# EAGLE design csense (EAGLE 5.11)
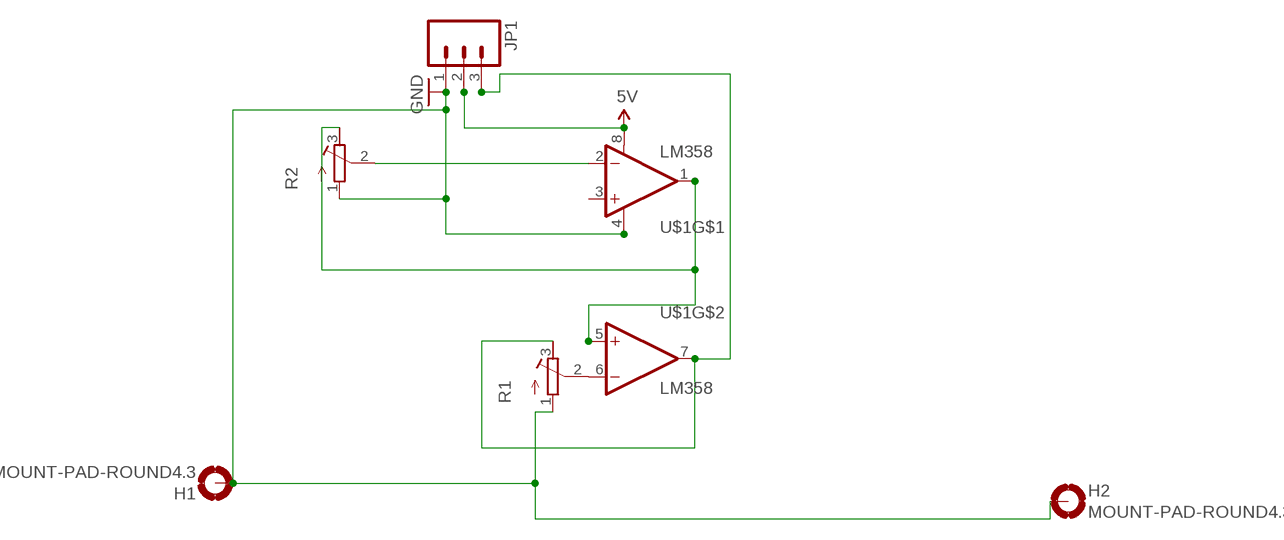
[diagram p0: schematic, sheet 1]

## Parts
H1  MOUNT-PAD-ROUND4.3  [4,3-PAD]
H2  MOUNT-PAD-ROUND4.3  [4,3-PAD]
JP1  M03PTH  [1X03]
R1  R-TRIMM64X  [RTRIM64X]
R2  R-TRIMM64X  [RTRIM64X]
U$1  LM358  [DIP08]

## Nets
5V: JP1.2 U$1.8(V+)
GND: H1.B4,3(MOUNT) H2.B4,3(MOUNT) JP1.1 R1.1(E) R2.1(E) U$1.4(V-)
N$3: R2.3(A) U$1.1(OUT) U$1.5(+IN)
N$4: JP1.3 R1.3(A) U$1.7(OUT)
N$6: R2.2(S) U$1.2(-IN)
N$8: R1.2(S) U$1.6(-IN)
Unconnected: U$1.3(+IN)

## Library data of the parts
H1 H2 = holes:MOUNT-PAD-ROUND: MOUNTING PAD, round
JP1 = SparkFun:M03: Header 3 Standard 3-pin 0.1" header. Use with straight break away headers (SKU : PRT-00116), right angle break away headers (PRT-00553), swiss pins (PRT-00743), machine pins (PRT-00117), and female headers (PRT-00115). Molex polarized connector foot print use with SKU : PRT-08232 with associated crimp pins and housings.
R1 R2 = rcl:R-TRIMM: Trimm resistor
U$1 = SparkFun:LM358

## Board
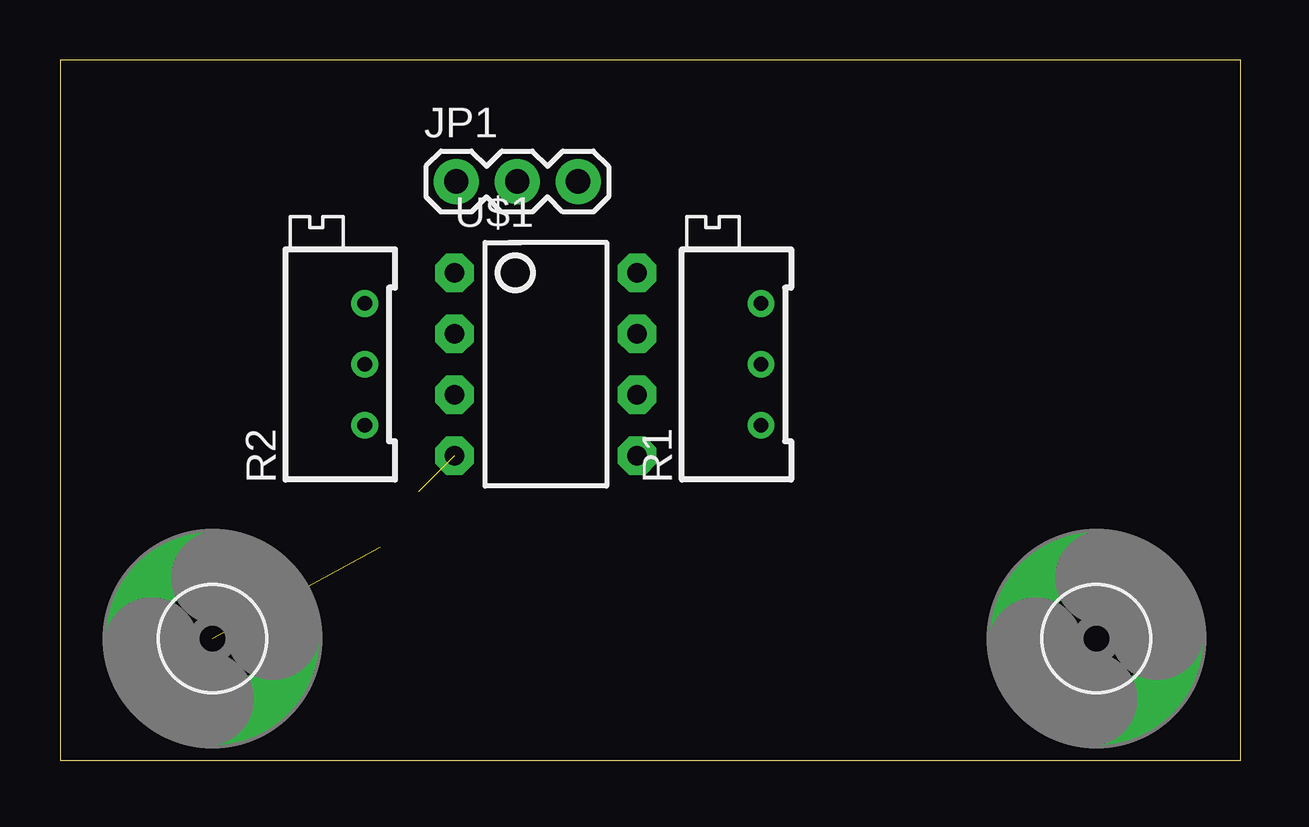
[diagram p1: board, top side]
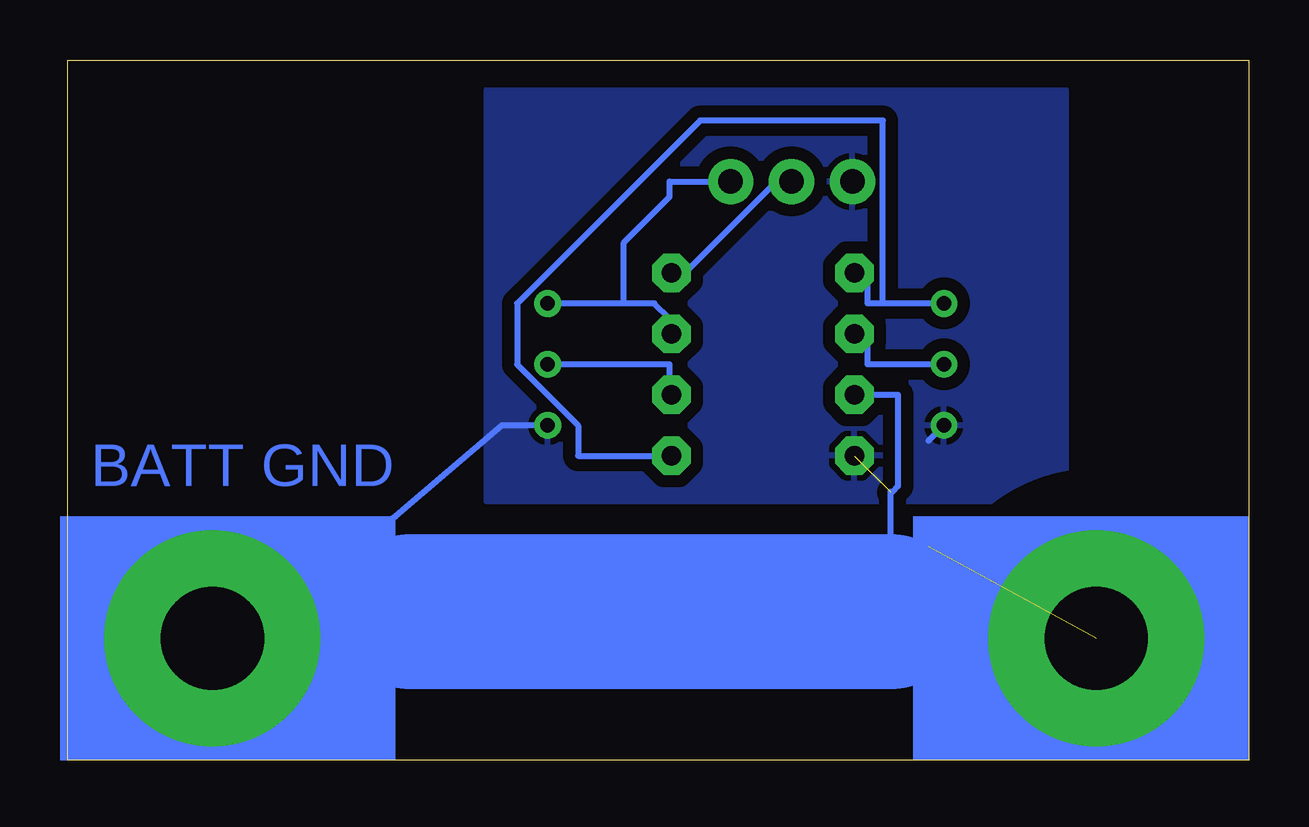
[diagram p2: board, bottom side, seen from below]

Size 49.2 x 29.2 mm. Coordinates in mm from the lower left corner, seen from the top.
Outline: 0,0 49.2,0 49.2,29.2 0,29.2 0,0
Copper layers (1*16): Top 0.035mm / dielectric 1.5mm / Bottom 0.035mm
Design rules "default": minimum track width 10mil, minimum drill 24mil, track to track 8mil, track to pad 8mil, pad to pad 8mil, via to via 8mil, smd to smd 8mil, copper to edge 40mil, drill to drill 8mil, minimum pad ring 10mil, minimum via ring 8mil, stop-mask expansion 4mil, vias tented up to drill 0mil, thermal gap 10mil

### Footprints (pad centres in the part's own frame; a part is rotated, then mirrored left to right if it is on the bottom)
4,3-PAD = drill 4.3 pad 9 round: B4,3 0,0
1X03 = drill 1.016 pad 1.88 round: 1 0,0; 2 2.54,0; 3 5.08,0
RTRIM64X = drill 0.61 round: 1 1.27,-2.54; 2 1.27,0; 3 1.27,2.54
DIP08 = drill 0.813 pad 1.6 octagon: 1 -3.81,-3.81; 2 -1.27,-3.81; 3 1.27,-3.81; 4 3.81,-3.81; 5 3.81,3.81; 6 1.27,3.81; 7 -1.27,3.81; 8 -3.81,3.81

### Placement (x,y rotation side)
H1  6.35,5.08 0 top
H2  43.18,5.08 0 top
JP1  16.51,24.13 0 top
R1  27.94,16.51 0 top
R2  11.43,16.51 0 top
U$1  20.24,16.51 270 top

### Tracks (layer width: path | path; a pad name or v marks a point on that pad's centre or on a via)
5V
  Bottom 0.254: U$1.8 23.5,20.32 19.05,24.77 JP1.2
GND  (2 unrouted)
  Bottom 0.254: U$1.4 16.51,12.7 | H2.B4,3 35.56,10.16 31.11,13.97 R1.1 | 14.92,11.19 14.92,6.19 13.34,8.89 | R2.1 13.34,13.34
  Bottom 6.452: 14.92,6.19 34.92,6.19
  pour Bottom: 13.97,10.16 13.97,0 0,0 0,10.16
  pour Bottom: 35.56,10.16 49.53,10.16 49.53,0 35.56,0
  pour Bottom (isolate 0.508): 7.62,10.79 31.75,10.79 31.75,27.94 7.62,27.94
N$1
  Bottom 0.254: 16.51,15.24 14.61,15.24 14.61,11.43 14.86,11.18
N$3
  Bottom 0.254: 15.24,19.05 15.88,19.05 15.88,20.32 U$1.1 | R2.3 15.24,19.05 | 15.24,19.05 15.24,26.67 22.86,26.67 30.48,19.05 30.48,16.51 27.94,13.97 27.94,12.7 U$1.5
N$4
  Bottom 0.254: 26.04,19.05 24.77,19.05 24.13,18.41 24.13,17.78 U$1.7 | 26.04,19.05 R1.3 | JP1.3 24.13,24.13 24.13,23.5 26.04,21.59 26.04,19.05
N$6
  Bottom 0.254: R2.2 15.88,16.51 15.88,17.78 U$1.2
N$8
  Bottom 0.254: R1.2 24.13,16.51 24.13,15.24 U$1.6
(copper drawn outside any net)
  shapes: Bottom area x2

### Text on the board
Bottom: BATT GND